# Altium schematic sheet SDRAM.SchDoc
size A
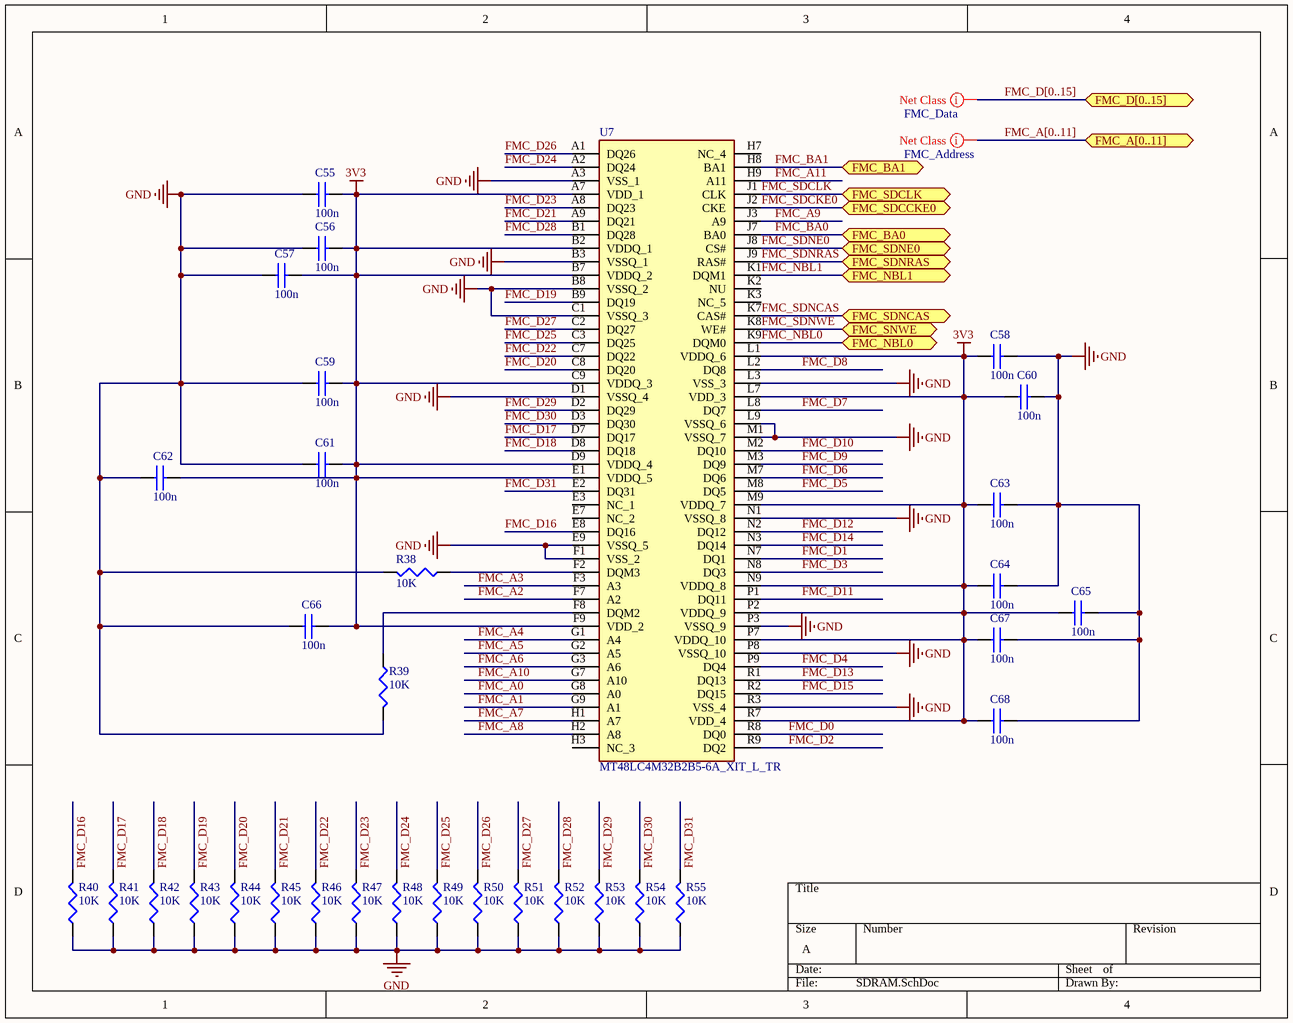
[diagram p0: SDRAM.SchDoc]

## Parts
C55  100n  [C0402]
C56  100n  [C0402]
C57  100n  [C0402]
C58  100n  [C0402]
C59  100n  [C0402]
C60  100n  [C0402]
C61  100n  [C0402]
C62  100n  [C0402]
C63  100n  [C0402]
C64  100n  [C0402]
C65  100n  [C0402]
C66  100n  [C0402]
C67  100n  [C0402]
C68  100n  [C0402]
R38  10K  [R0402]
R39  10K  [R0402]
R40  10K  [R0402]
R41  10K  [R0402]
R42  10K  [R0402]
R43  10K  [R0402]
R44  10K  [R0402]
R45  10K  [R0402]
R46  10K  [R0402]
R47  10K  [R0402]
R48  10K  [R0402]
R49  10K  [R0402]
R50  10K  [R0402]
R51  10K  [R0402]
R52  10K  [R0402]
R53  10K  [R0402]
R54  10K  [R0402]
R55  10K  [R0402]
U7  MT48LC4M32B2B5-6A_XIT_L_TR  [BGA90C80P9X15_800X1300X70]

## Ports
FMC_A[0..11] (bidir), FMC_BA0 (bidir), FMC_BA1 (bidir), FMC_D[0..15] (bidir), FMC_NBL0 (bidir), FMC_NBL1 (bidir), FMC_SDCCKE0 (bidir), FMC_SDCLK (bidir), FMC_SDNCAS (bidir), FMC_SDNE0 (bidir), FMC_SDNRAS (bidir), FMC_SNWE (bidir)

## Nets
3V3: C55.2 C56.2 C57.2 C58.1 C59.2 C60.1 C61.2 C62.2 C63.1 C64.1 C65.1 C66.2 C67.1 C68.1 U7.A7(VDD_1) U7.B2(VDDQ_1) U7.B7(VDDQ_2) U7.C9(VDDQ_3) U7.D9(VDDQ_4) U7.E1(VDDQ_5) U7.F9(VDD_2) U7.L1(VDDQ_6) U7.L7(VDD_3) U7.M9(VDDQ_7) U7.N9(VDDQ_8) U7.P2(VDDQ_9) U7.P7(VDDQ_10) U7.R7(VDD_4)
GND: C55.1 C56.1 C57.1 C58.2 C59.1 C60.2 C61.1 C62.1 C63.2 C64.2 C65.2 C66.1 C67.2 C68.2 R38.2 R39.2 R40.1 R41.1 R42.1 R43.1 R44.1 R45.1 R46.1 R47.1 R48.1 R49.1 R50.1 R51.1 R52.1 R53.1 R54.1 R55.1 U7.A3(VSS_1) U7.B3(VSSQ_1) U7.B8(VSSQ_2) U7.C1(VSSQ_3) U7.D1(VSSQ_4) U7.E9(VSSQ_5) U7.F1(VSS_2) U7.L3(VSS_3) U7.L9(VSSQ_6) U7.M1(VSSQ_7) U7.N1(VSSQ_8) U7.P3(VSSQ_9) U7.P8(VSSQ_10) U7.R3(VSS_4)
FMC_A0: U7.G8(A0)
FMC_A1: U7.G9(A1)
FMC_A2: U7.F7(A2)
FMC_A3: U7.F3(A3)
FMC_A4: U7.G1(A4)
FMC_A5: U7.G2(A5)
FMC_A6: U7.G3(A6)
FMC_A7: U7.H1(A7)
FMC_A8: U7.H2(A8)
FMC_A9: U7.J3(A9)
FMC_A10: U7.G7(A10)
FMC_A11: U7.H9(A11)
FMC_BA0: U7.J7(BA0) ; port FMC_BA0
FMC_BA1: U7.H8(BA1) ; port FMC_BA1
FMC_D0: U7.R8(DQ0)
FMC_D1: U7.N7(DQ1)
FMC_D2: U7.R9(DQ2)
FMC_D3: U7.N8(DQ3)
FMC_D4: U7.P9(DQ4)
FMC_D5: U7.M8(DQ5)
FMC_D6: U7.M7(DQ6)
FMC_D7: U7.L8(DQ7)
FMC_D8: U7.L2(DQ8)
FMC_D9: U7.M3(DQ9)
FMC_D10: U7.M2(DQ10)
FMC_D11: U7.P1(DQ11)
FMC_D12: U7.N2(DQ12)
FMC_D13: U7.R1(DQ13)
FMC_D14: U7.N3(DQ14)
FMC_D15: U7.R2(DQ15)
FMC_D16: R40.2 U7.E8(DQ16)
FMC_D17: R41.2 U7.D7(DQ17)
FMC_D18: R42.2 U7.D8(DQ18)
FMC_D19: R43.2 U7.B9(DQ19)
FMC_D20: R44.2 U7.C8(DQ20)
FMC_D21: R45.2 U7.A9(DQ21)
FMC_D22: R46.2 U7.C7(DQ22)
FMC_D23: R47.2 U7.A8(DQ23)
FMC_D24: R48.2 U7.A2(DQ24)
FMC_D25: R49.2 U7.C3(DQ25)
FMC_D26: R50.2 U7.A1(DQ26)
FMC_D27: R51.2 U7.C2(DQ27)
FMC_D28: R52.2 U7.B1(DQ28)
FMC_D29: R53.2 U7.D2(DQ29)
FMC_D30: R54.2 U7.D3(DQ30)
FMC_D31: R55.2 U7.E2(DQ31)
FMC_NBL0: U7.K9(DQM0) ; port FMC_NBL0
FMC_NBL1: U7.K1(DQM1) ; port FMC_NBL1
FMC_SDCKE0: U7.J2(CKE) ; port FMC_SDCCKE0
FMC_SDCLK: U7.J1(CLK) ; port FMC_SDCLK
FMC_SDNCAS: U7.K7(CAS#) ; port FMC_SDNCAS
FMC_SDNE0: U7.J8(CS#) ; port FMC_SDNE0
FMC_SDNRAS: U7.J9(RAS#) ; port FMC_SDNRAS
FMC_SDNWE: U7.K8(WE#) ; port FMC_SNWE
NetR38_1: R38.1 U7.F2(DQM3)
NetR39_1: R39.1 U7.F8(DQM2)

Not connected (* = marked no-connect by the designer): U7 E3(NC_1) E7(NC_2) H3(NC_3) H7(NC_4) K2(NU) K3(NC_5)

## Buses and harness runs
bus FMC_A[0..11] = port FMC_A[0..11]
bus FMC_D[0..15] = port FMC_D[0..15]

## Layout directives
net class FMC_Data: (no net found under the mark)
net class FMC_Address: (no net found under the mark)

## Library data of the parts
C55-C68 = C1005X5R1H104K: CAP CER .10UF 50V X5R 10% 0402; Manufacturer: TDK Corporation; Capacitance: 0.1µF; Value: 100nF; .Checked PCB: used; Category: Capacitors; Supplier Part Number: 445-5942-1-ND; Manufacturer Part Number: C1005X5R1H104K; Operating Temperature: -55°C ~ 85°C; Package / Case: 0402 (1005 Metric); Price 1k [$]: 0.02340; .Checked SCH: used; Voltage - Rated: 50V; Supplier: Digikey; Supplier 1: Digi-Key; Supplier Part Number 1: 445-5942-1-ND; RoHS: RoHS Compliant; Stock 1: 106926; Pricing 1: 1=0.27, 10=0.18, 100=0.072, 250=0.05176, 500=0.0369, 1000=0.027 (USD); Tolerance: ±10%; Temperature Coefficient: X5R; Mounting Type: Surface Mount, MLCC; Applications: General Purpose; Ratings: -; Size / Dimension: 0.039" L x 0.020" W (1.00mm x 0.50mm); Height - Seated (Max): -; Thickness (Max): 0.022" (0.55mm); Lead Spacing: -; Features: -; Packaging: Cut Tape (CT); Lead Style: -; ComponentLink1URL: http://www.tdk.co.jp/tefe02/e412_c.pdf; ComponentLink1Description: http://www.tdk.co.jp/tefe02/e412_c.pdf
R38-R55 = RC0402FR-0710KL: RES 10.0K OHM 1/16W 1% 0402 SMD; Manufacturer: Yageo; Power (Watts): 0.063W, 1/16W; .Checked PCB: used; Temperature Coefficient: ±100ppm/°C; Category: Resistors; Supplier Part Number: 311-10.0KLRCT-ND; Manufacturer Part Number: RC0402FR-0710KL; Package / Case: 0402 (1005 Metric); Price 1k [$]: 0.01421; Resistance (Ohms): 10K; Tolerance: ±1%; Value: 10k; .Checked SCH: used; Supplier: Digikey; Supplier 1: Digi-Key; Supplier Part Number 1: 311-10.0KLRCT-ND; RoHS: RoHS Compliant; Stock 1: 2916495; Pricing 1: 10=0.014, 50=0.0104, 100=0.0079, 250=0.00584, 500=0.00432, 1000=0.00288 (USD); Composition: Thick Film; Features: -; Size / Dimension: 0.039" L x 0.020" W (1.00mm x 0.50mm); Height: 0.016" (0.40mm); Number of Terminations: 2; Packaging: Cut Tape (CT); ComponentLink1URL: http://www.yageo.com/documents/recent/PYu-RC0402_51_RoHS_L_6.pdf; ComponentLink1Description: http://www.yageo.com/documents/recent/PYu-RC0402_51_RoHS_L_6.pdf
U7 = MT48LC4M32B2B5-6A_XIT_L_TR: Integrated Circuit; Manufacturer_Name: Micron; Manufacturer_Part_Number: MT48LC4M32B2B5-6A XIT:L TR; Datasheet Link: http://www.micron.com/~/media/Documents/Products/Data%20Sheet/DRAM/128mb_x32_sdram.pdf; Height: 0.7mm; Mouser Part Number: 340-140098-REEL; Mouser Price/Stock: https://www.mouser.com/Search/Refine.aspx?Keyword=340-140098-REEL